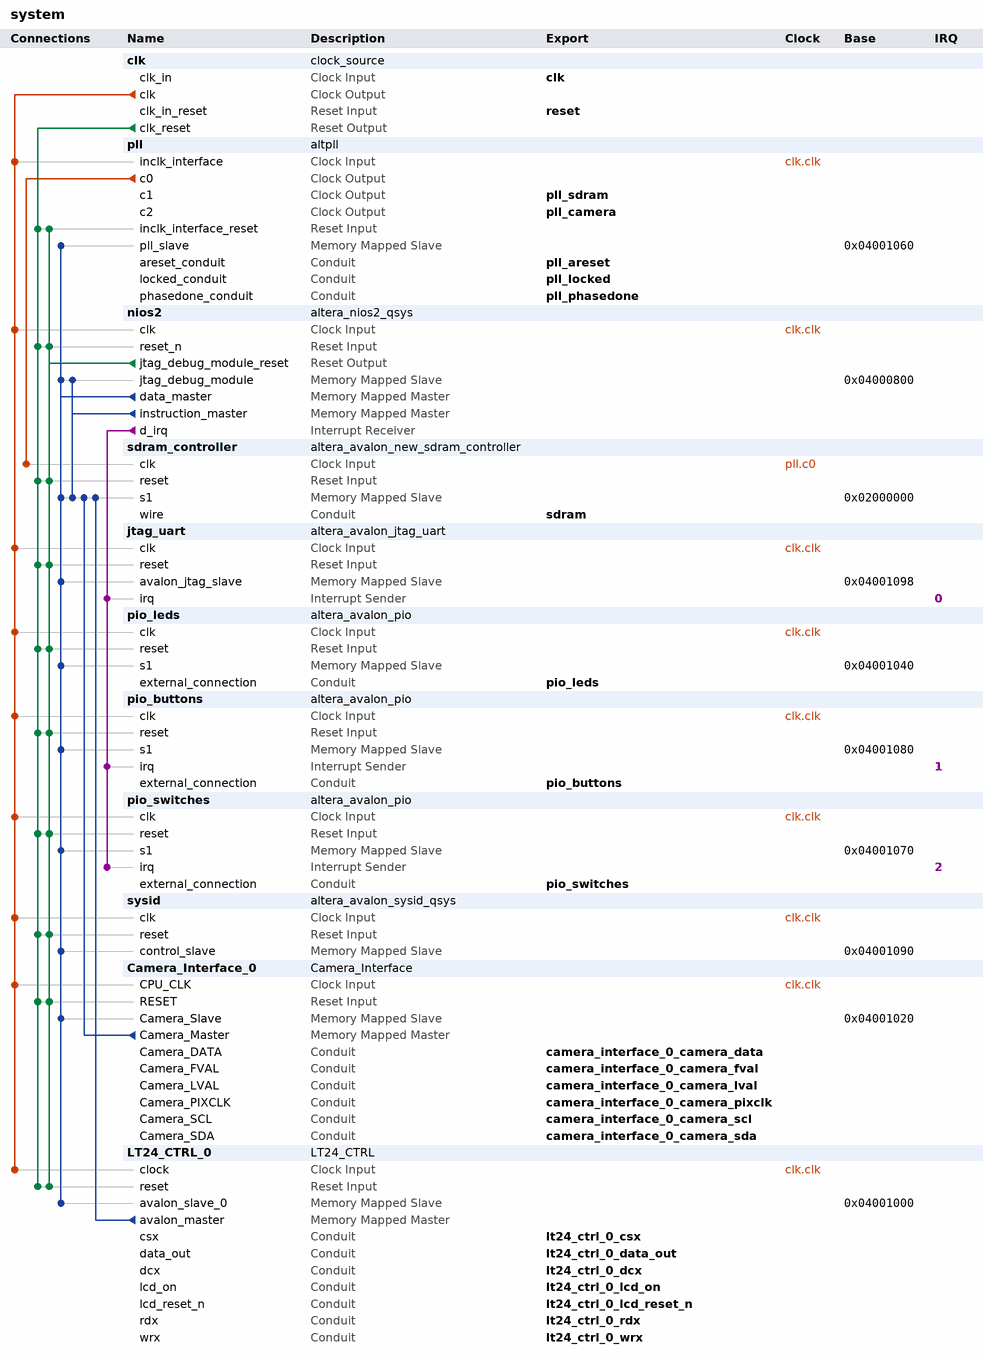
[diagram p0: system contents]
# Platform Designer (Qsys) system system, Cyclone IV E EP4CE22F17C6
# Parameters at their usual value, and those the tool derives, are not listed.
package require -exact qsys 14.0
create_system system
set_project_property DEVICE_FAMILY {Cyclone IV E}
set_project_property DEVICE EP4CE22F17C6

add_instance clk clock_source 14.0
set_instance_parameter_value clk clockFrequency 50000000

add_instance pll altpll 14.0
set_instance_parameter_value pll INCLK0_INPUT_FREQUENCY 20000
set_instance_parameter_value pll CLK0_MULTIPLY_BY 2
set_instance_parameter_value pll CLK1_MULTIPLY_BY 2
set_instance_parameter_value pll CLK2_MULTIPLY_BY 1
set_instance_parameter_value pll CLK0_DIVIDE_BY 1
set_instance_parameter_value pll CLK1_DIVIDE_BY 1
set_instance_parameter_value pll CLK2_DIVIDE_BY 5
set_instance_parameter_value pll CLK1_PHASE_SHIFT -3000
set_instance_parameter_value pll CLK2_PHASE_SHIFT 0
set_instance_parameter_value pll CLK1_DUTY_CYCLE 50
set_instance_parameter_value pll CLK2_DUTY_CYCLE 50
set_instance_parameter_value pll PORT_clk1 PORT_USED
set_instance_parameter_value pll PORT_clk2 PORT_USED
set_instance_parameter_value pll PORT_clk3 PORT_UNUSED
set_instance_parameter_value pll PORT_ARESET PORT_UNUSED
set_instance_parameter_value pll PORT_LOCKED PORT_UNUSED

add_instance nios2 altera_nios2_qsys 14.0
set_instance_parameter_value nios2 resetrequest_enabled true
set_instance_parameter_value nios2 resetSlave sdram_controller.s1
set_instance_parameter_value nios2 mmu_TLBMissExcSlave None
set_instance_parameter_value nios2 exceptionSlave sdram_controller.s1
set_instance_parameter_value nios2 breakSlave nios2.jtag_debug_module
set_instance_parameter_value nios2 impl Fast
set_instance_parameter_value nios2 icache_size 4096

add_instance sdram_controller altera_avalon_new_sdram_controller 14.0
set_instance_parameter_value sdram_controller TAC 6.5
set_instance_parameter_value sdram_controller TRCD 20.0
set_instance_parameter_value sdram_controller TRP 20.0
set_instance_parameter_value sdram_controller casLatency 2
set_instance_parameter_value sdram_controller columnWidth 9
set_instance_parameter_value sdram_controller dataWidth 16
set_instance_parameter_value sdram_controller generateSimulationModel false
set_instance_parameter_value sdram_controller initRefreshCommands 8
set_instance_parameter_value sdram_controller model single_Micron_MT48LC4M32B2_7_chip
set_instance_parameter_value sdram_controller numberOfBanks 4
set_instance_parameter_value sdram_controller numberOfChipSelects 1
set_instance_parameter_value sdram_controller powerUpDelay 200.0
set_instance_parameter_value sdram_controller refreshPeriod 0.75
set_instance_parameter_value sdram_controller rowWidth 13

add_instance jtag_uart altera_avalon_jtag_uart 14.0
set_instance_parameter_value jtag_uart simInteractiveOptions NO_INTERACTIVE_WINDOWS

add_instance pio_leds altera_avalon_pio 14.0
set_instance_parameter_value pio_leds bitModifyingOutReg true
set_instance_parameter_value pio_leds direction Output
set_instance_parameter_value pio_leds width 8

add_instance pio_buttons altera_avalon_pio 14.0
set_instance_parameter_value pio_buttons bitClearingEdgeCapReg true
set_instance_parameter_value pio_buttons captureEdge true
set_instance_parameter_value pio_buttons direction Input
set_instance_parameter_value pio_buttons generateIRQ true
set_instance_parameter_value pio_buttons width 2

add_instance pio_switches altera_avalon_pio 14.0
set_instance_parameter_value pio_switches bitClearingEdgeCapReg true
set_instance_parameter_value pio_switches captureEdge true
set_instance_parameter_value pio_switches direction Input
set_instance_parameter_value pio_switches generateIRQ true
set_instance_parameter_value pio_switches width 4

add_instance sysid altera_avalon_sysid_qsys 14.0
set_instance_parameter_value sysid id 305419896

add_instance Camera_Interface_0 Camera_Interface 1.0

add_instance LT24_CTRL_0 LT24_CTRL 1.0

# connections
add_connection clk.clk Camera_Interface_0.CPU_CLK clock
add_connection clk.clk jtag_uart.clk clock
add_connection clk.clk LT24_CTRL_0.clock clock
add_connection clk.clk nios2.clk clock
add_connection clk.clk pio_buttons.clk clock
add_connection clk.clk pio_leds.clk clock
add_connection clk.clk pio_switches.clk clock
add_connection clk.clk pll.inclk_interface clock
add_connection clk.clk sysid.clk clock
add_connection pll.c0 sdram_controller.clk clock
add_connection clk.clk_reset Camera_Interface_0.RESET reset
add_connection clk.clk_reset jtag_uart.reset reset
add_connection clk.clk_reset LT24_CTRL_0.reset reset
add_connection clk.clk_reset nios2.reset_n reset
add_connection clk.clk_reset pio_buttons.reset reset
add_connection clk.clk_reset pio_leds.reset reset
add_connection clk.clk_reset pio_switches.reset reset
add_connection clk.clk_reset pll.inclk_interface_reset reset
add_connection clk.clk_reset sdram_controller.reset reset
add_connection clk.clk_reset sysid.reset reset
add_connection nios2.jtag_debug_module_reset Camera_Interface_0.RESET reset
add_connection nios2.jtag_debug_module_reset jtag_uart.reset reset
add_connection nios2.jtag_debug_module_reset LT24_CTRL_0.reset reset
add_connection nios2.jtag_debug_module_reset nios2.reset_n reset
add_connection nios2.jtag_debug_module_reset pio_buttons.reset reset
add_connection nios2.jtag_debug_module_reset pio_leds.reset reset
add_connection nios2.jtag_debug_module_reset pio_switches.reset reset
add_connection nios2.jtag_debug_module_reset pll.inclk_interface_reset reset
add_connection nios2.jtag_debug_module_reset sdram_controller.reset reset
add_connection nios2.jtag_debug_module_reset sysid.reset reset
add_connection Camera_Interface_0.Camera_Master sdram_controller.s1 avalon
set_connection_parameter_value Camera_Interface_0.Camera_Master/sdram_controller.s1 baseAddress 0x02000000
add_connection LT24_CTRL_0.avalon_master sdram_controller.s1 avalon
set_connection_parameter_value LT24_CTRL_0.avalon_master/sdram_controller.s1 baseAddress 0x02000000
add_connection nios2.data_master Camera_Interface_0.Camera_Slave avalon
set_connection_parameter_value nios2.data_master/Camera_Interface_0.Camera_Slave baseAddress 0x04001020
add_connection nios2.data_master jtag_uart.avalon_jtag_slave avalon
set_connection_parameter_value nios2.data_master/jtag_uart.avalon_jtag_slave baseAddress 0x04001098
add_connection nios2.data_master LT24_CTRL_0.avalon_slave_0 avalon
set_connection_parameter_value nios2.data_master/LT24_CTRL_0.avalon_slave_0 baseAddress 0x04001000
add_connection nios2.data_master nios2.jtag_debug_module avalon
set_connection_parameter_value nios2.data_master/nios2.jtag_debug_module baseAddress 0x04000800
add_connection nios2.data_master pio_buttons.s1 avalon
set_connection_parameter_value nios2.data_master/pio_buttons.s1 baseAddress 0x04001080
add_connection nios2.data_master pio_leds.s1 avalon
set_connection_parameter_value nios2.data_master/pio_leds.s1 baseAddress 0x04001040
add_connection nios2.data_master pio_switches.s1 avalon
set_connection_parameter_value nios2.data_master/pio_switches.s1 baseAddress 0x04001070
add_connection nios2.data_master pll.pll_slave avalon
set_connection_parameter_value nios2.data_master/pll.pll_slave baseAddress 0x04001060
add_connection nios2.data_master sdram_controller.s1 avalon
set_connection_parameter_value nios2.data_master/sdram_controller.s1 baseAddress 0x02000000
add_connection nios2.data_master sysid.control_slave avalon
set_connection_parameter_value nios2.data_master/sysid.control_slave baseAddress 0x04001090
add_connection nios2.instruction_master nios2.jtag_debug_module avalon
set_connection_parameter_value nios2.instruction_master/nios2.jtag_debug_module baseAddress 0x04000800
add_connection nios2.instruction_master sdram_controller.s1 avalon
set_connection_parameter_value nios2.instruction_master/sdram_controller.s1 baseAddress 0x02000000
add_connection nios2.d_irq jtag_uart.irq interrupt
set_connection_parameter_value nios2.d_irq/jtag_uart.irq irqNumber 0
add_connection nios2.d_irq pio_buttons.irq interrupt
set_connection_parameter_value nios2.d_irq/pio_buttons.irq irqNumber 1
add_connection nios2.d_irq pio_switches.irq interrupt
set_connection_parameter_value nios2.d_irq/pio_switches.irq irqNumber 2

# exported interfaces
add_interface clk clock sink
set_interface_property clk EXPORT_OF clk.clk_in
add_interface reset reset sink
set_interface_property reset EXPORT_OF clk.clk_in_reset
add_interface sdram conduit end
set_interface_property sdram EXPORT_OF sdram_controller.wire
add_interface pio_leds conduit end
set_interface_property pio_leds EXPORT_OF pio_leds.external_connection
add_interface pio_buttons conduit end
set_interface_property pio_buttons EXPORT_OF pio_buttons.external_connection
add_interface pio_switches conduit end
set_interface_property pio_switches EXPORT_OF pio_switches.external_connection
add_interface pll_sdram clock source
set_interface_property pll_sdram EXPORT_OF pll.c1
add_interface pll_areset conduit end
set_interface_property pll_areset EXPORT_OF pll.areset_conduit
add_interface pll_locked conduit end
set_interface_property pll_locked EXPORT_OF pll.locked_conduit
add_interface pll_phasedone conduit end
set_interface_property pll_phasedone EXPORT_OF pll.phasedone_conduit
add_interface pll_camera clock source
set_interface_property pll_camera EXPORT_OF pll.c2
add_interface camera_interface_0_camera_pixclk conduit end
set_interface_property camera_interface_0_camera_pixclk EXPORT_OF Camera_Interface_0.Camera_PIXCLK
add_interface camera_interface_0_camera_data conduit end
set_interface_property camera_interface_0_camera_data EXPORT_OF Camera_Interface_0.Camera_DATA
add_interface camera_interface_0_camera_lval conduit end
set_interface_property camera_interface_0_camera_lval EXPORT_OF Camera_Interface_0.Camera_LVAL
add_interface camera_interface_0_camera_fval conduit end
set_interface_property camera_interface_0_camera_fval EXPORT_OF Camera_Interface_0.Camera_FVAL
add_interface camera_interface_0_camera_scl conduit end
set_interface_property camera_interface_0_camera_scl EXPORT_OF Camera_Interface_0.Camera_SCL
add_interface camera_interface_0_camera_sda conduit end
set_interface_property camera_interface_0_camera_sda EXPORT_OF Camera_Interface_0.Camera_SDA
add_interface lt24_ctrl_0_lcd_reset_n conduit end
set_interface_property lt24_ctrl_0_lcd_reset_n EXPORT_OF LT24_CTRL_0.lcd_reset_n
add_interface lt24_ctrl_0_lcd_on conduit end
set_interface_property lt24_ctrl_0_lcd_on EXPORT_OF LT24_CTRL_0.lcd_on
add_interface lt24_ctrl_0_csx conduit end
set_interface_property lt24_ctrl_0_csx EXPORT_OF LT24_CTRL_0.csx
add_interface lt24_ctrl_0_wrx conduit end
set_interface_property lt24_ctrl_0_wrx EXPORT_OF LT24_CTRL_0.wrx
add_interface lt24_ctrl_0_rdx conduit end
set_interface_property lt24_ctrl_0_rdx EXPORT_OF LT24_CTRL_0.rdx
add_interface lt24_ctrl_0_data_out conduit end
set_interface_property lt24_ctrl_0_data_out EXPORT_OF LT24_CTRL_0.data_out
add_interface lt24_ctrl_0_dcx conduit end
set_interface_property lt24_ctrl_0_dcx EXPORT_OF LT24_CTRL_0.dcx

set_interconnect_requirement {$system} qsys_mm.clockCrossingAdapter HANDSHAKE
set_interconnect_requirement {$system} qsys_mm.maxAdditionalLatency 1
set_interconnect_requirement {$system} qsys_mm.insertDefaultSlave FALSE

save_system system.qsys
